# Altium schematic sheet 电源通道电路.SchDoc
size 508 x 762 mm
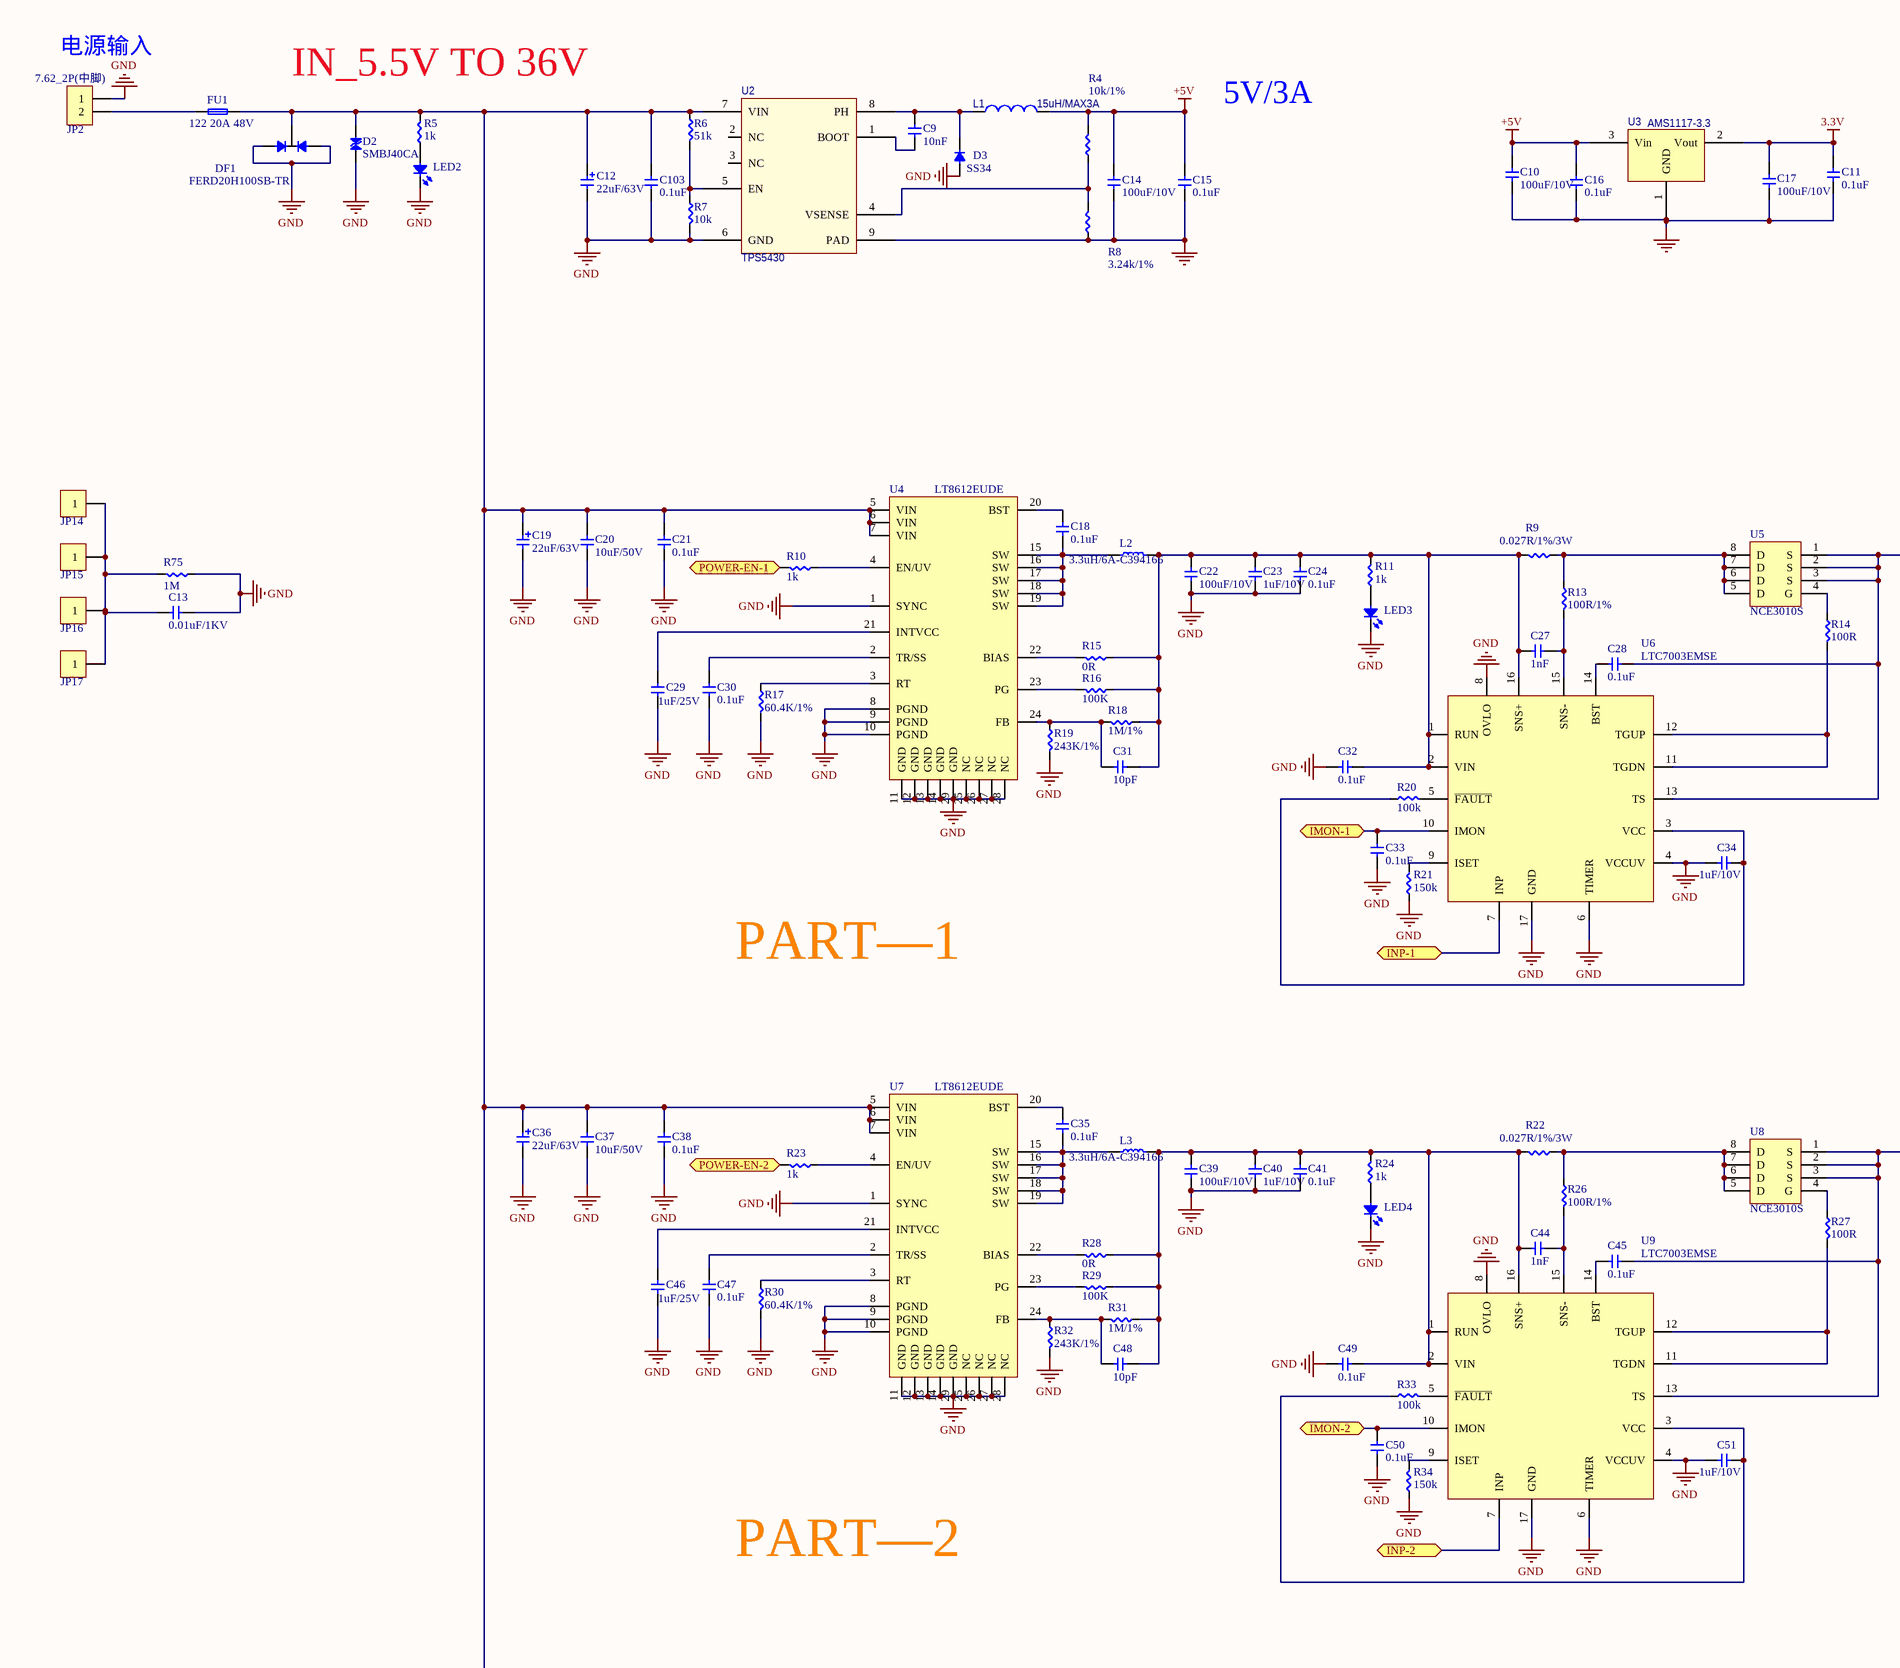
[diagram p0: 电源通道电路.SchDoc, top left]
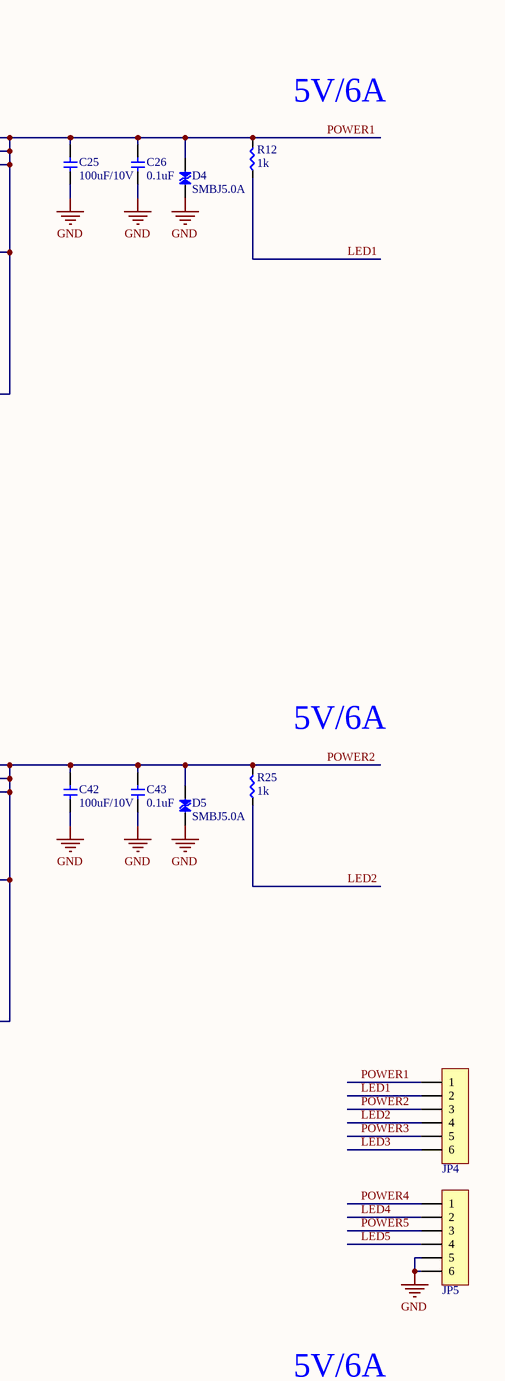
[diagram p1: 电源通道电路.SchDoc, top right]
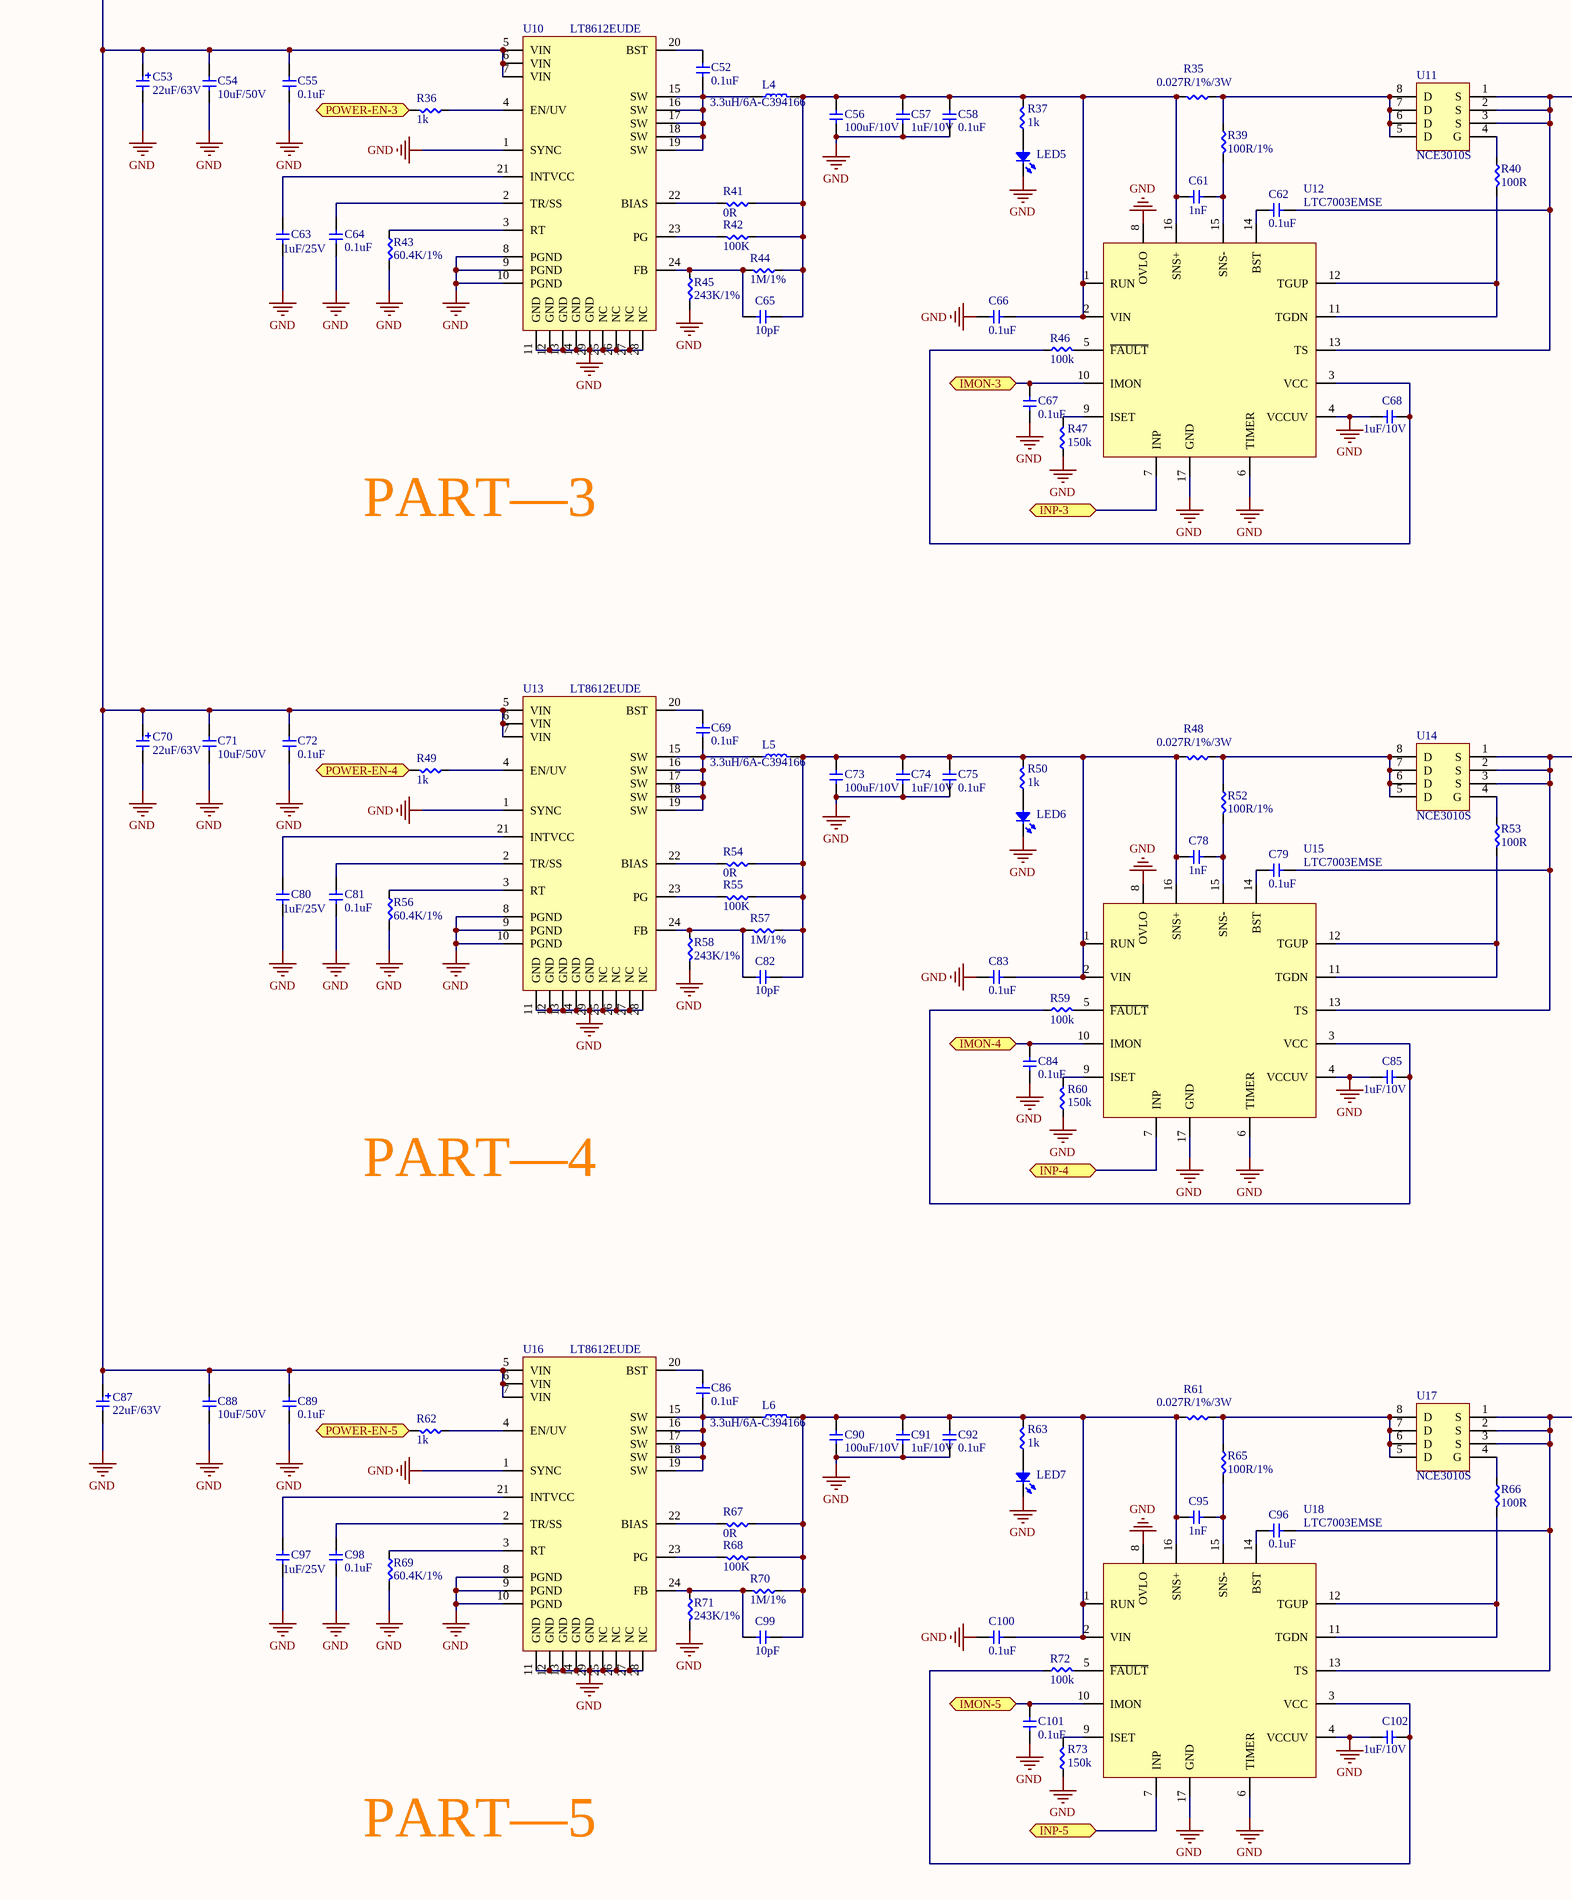
[diagram p2: 电源通道电路.SchDoc, bottom left]
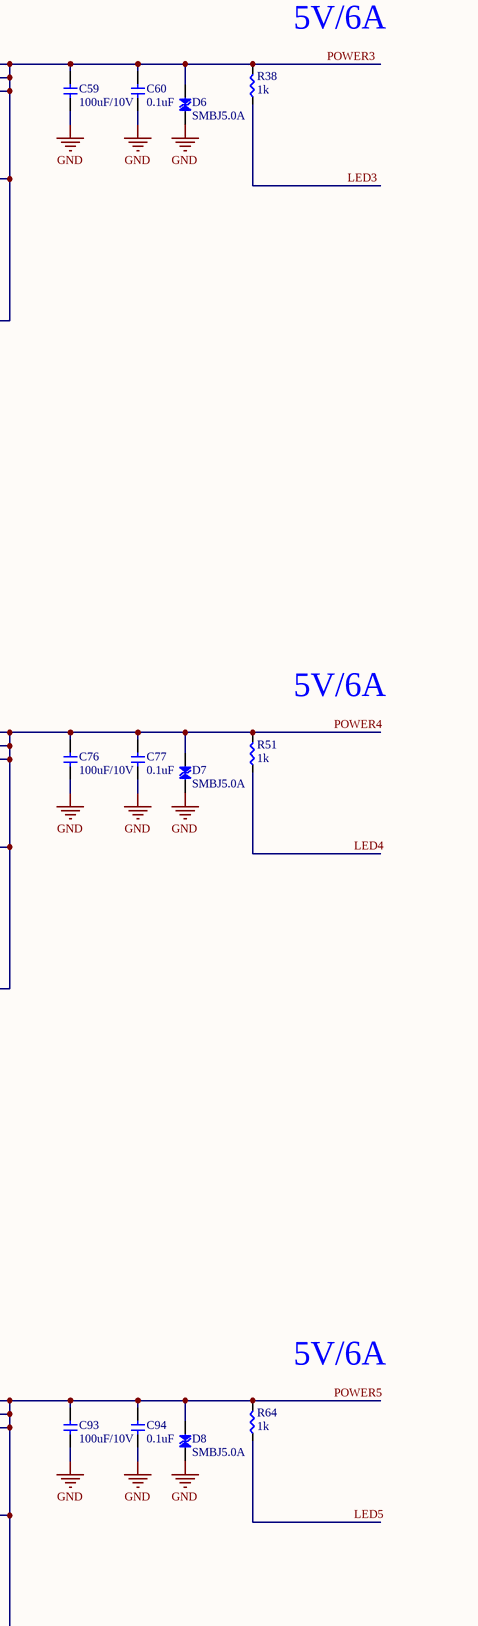
[diagram p3: 电源通道电路.SchDoc, bottom right]

## Parts
C9  10nF  [C 0603_M]
C10  100uF/10V  [CT 5*6 - R]
C11  0.1uF  [C 0603_M]
C12  22uF/63V  [CT 8*7 - C]
C13  0.01uF/1KV  [C 1210_M]
C14  100uF/10V  [CT 5*6 - R]
C15  0.1uF  [C 0603_M]
C16  0.1uF  [C 0603_M]
C17  100uF/10V  [CT 5*6 - R]
C18  0.1uF  [C 0603_M]
C19  22uF/63V  [CT 8*7 - C]
C20  10uF/50V  [C 1206_M]
C21  0.1uF  [C 0603_M]
C22  100uF/10V  [CT 5*6 - R]
C23  1uF/10V  [C 0603_M]
C24  0.1uF  [C 0603_M]
C25  100uF/10V  [CT 5*6 - R]
C26  0.1uF  [C 0603_M]
C27  1nF  [C 0603_M]
C28  0.1uF  [C 0603_M]
C29  1uF/25V  [C 0603_M]
C30  0.1uF  [C 0603_M]
C31  10pF  [C 0603_M]
C32  0.1uF  [C 0603_M]
C33  0.1uF  [C 0603_M]
C34  1uF/10V  [C 0603_M]
C35  0.1uF  [C 0603_M]
C36  22uF/63V  [CT 8*7 - C]
C37  10uF/50V  [C 1206_M]
C38  0.1uF  [C 0603_M]
C39  100uF/10V  [CT 5*6 - R]
C40  1uF/10V  [C 0603_M]
C41  0.1uF  [C 0603_M]
C42  100uF/10V  [CT 5*6 - R]
C43  0.1uF  [C 0603_M]
C44  1nF  [C 0603_M]
C45  0.1uF  [C 0603_M]
C46  1uF/25V  [C 0603_M]
C47  0.1uF  [C 0603_M]
C48  10pF  [C 0603_M]
C49  0.1uF  [C 0603_M]
C50  0.1uF  [C 0603_M]
C51  1uF/10V  [C 0603_M]
C52  0.1uF  [C 0603_M]
C53  22uF/63V  [CT 8*7 - C]
C54  10uF/50V  [C 1206_M]
C55  0.1uF  [C 0603_M]
C56  100uF/10V  [CT 5*6 - R]
C57  1uF/10V  [C 0603_M]
C58  0.1uF  [C 0603_M]
C59  100uF/10V  [CT 5*6 - R]
C60  0.1uF  [C 0603_M]
C61  1nF  [C 0603_M]
C62  0.1uF  [C 0603_M]
C63  1uF/25V  [C 0603_M]
C64  0.1uF  [C 0603_M]
C65  10pF  [C 0603_M]
C66  0.1uF  [C 0603_M]
C67  0.1uF  [C 0603_M]
C68  1uF/10V  [C 0603_M]
C69  0.1uF  [C 0603_M]
C70  22uF/63V  [CT 8*7 - C]
C71  10uF/50V  [C 1206_M]
C72  0.1uF  [C 0603_M]
C73  100uF/10V  [CT 5*6 - R]
C74  1uF/10V  [C 0603_M]
C75  0.1uF  [C 0603_M]
C76  100uF/10V  [CT 5*6 - R]
C77  0.1uF  [C 0603_M]
C78  1nF  [C 0603_M]
C79  0.1uF  [C 0603_M]
C80  1uF/25V  [C 0603_M]
C81  0.1uF  [C 0603_M]
C82  10pF  [C 0603_M]
C83  0.1uF  [C 0603_M]
C84  0.1uF  [C 0603_M]
C85  1uF/10V  [C 0603_M]
C86  0.1uF  [C 0603_M]
C87  22uF/63V  [CT 8*7 - C]
C88  10uF/50V  [C 1206_M]
C89  0.1uF  [C 0603_M]
C90  100uF/10V  [CT 5*6 - R]
C91  1uF/10V  [C 0603_M]
C92  0.1uF  [C 0603_M]
C93  100uF/10V  [CT 5*6 - R]
C94  0.1uF  [C 0603_M]
C95  1nF  [C 0603_M]
C96  0.1uF  [C 0603_M]
C97  1uF/25V  [C 0603_M]
C98  0.1uF  [C 0603_M]
C99  10pF  [C 0603_M]
C100  0.1uF  [C 0603_M]
C101  0.1uF  [C 0603_M]
C102  1uF/10V  [C 0603_M]
C103  0.1uF  [C 0603_M]
D2  SMBJ40CA  [SMB - TVS]
D3  SS34  [SMA]
D4  SMBJ5.0A  [SMB - TVS]
D5  SMBJ5.0A  [SMB - TVS]
D6  SMBJ5.0A  [SMB - TVS]
D7  SMBJ5.0A  [SMB - TVS]
D8  SMBJ5.0A  [SMB - TVS]
DF1  FERD20H100SB-TR  [DPAK_FERD20H100SB-TR]
FU1  122 20A 48V  [R 1206_M]
JP2  7.62_2P(中脚)  [7.62_2P(中脚)]
JP4  HDR-1X6  [7.62_6P(中脚)]  (value not drawn)
JP5  HDR-1X6  [7.62_6P(中脚)]  (value not drawn)
JP14  冷压插片  [M3 125X300]  (value not drawn)
JP15  冷压插片  [M3 125X300]  (value not drawn)
JP16  冷压插片  [M3 125X300]  (value not drawn)
JP17  冷压插片  [M3 125X300]  (value not drawn)
L1  15uH/MAX3A  [CDRH74]
L2  3.3uH/6A-C394166  [7045]
L3  3.3uH/6A-C394166  [7045]
L4  3.3uH/6A-C394166  [7045]
L5  3.3uH/6A-C394166  [7045]
L6  3.3uH/6A-C394166  [7045]
LED2  LED  [LED 0603G]  (value not drawn)
LED3  LED  [LED 0603G]  (value not drawn)
LED4  LED  [LED 0603G]  (value not drawn)
LED5  LED  [LED 0603G]  (value not drawn)
LED6  LED  [LED 0603G]  (value not drawn)
LED7  LED  [LED 0603G]  (value not drawn)
R4  10k/1%  [R 0603_M]
R5  1k  [R 0603_M]
R6  51k  [R 0603_M]
R7  10k  [R 0603_M]
R8  3.24k/1%  [R 0603_M]
R9  0.027R/1%/3W  [R 2512_M]
R10  1k  [R 0603_M]
R11  1k  [R 0603_M]
R12  1k  [R 0603_M]
R13  100R/1%  [R 0603_M]
R14  100R  [R 0603_M]
R15  0R  [R 0603_M]
R16  100K  [R 0603_M]
R17  60.4K/1%  [R 0603_M]
R18  1M/1%  [R 0603_M]
R19  243K/1%  [R 0603_M]
R20  100k  [R 0603_M]
R21  150k  [R 0603_M]
R22  0.027R/1%/3W  [R 2512_M]
R23  1k  [R 0603_M]
R24  1k  [R 0603_M]
R25  1k  [R 0603_M]
R26  100R/1%  [R 0603_M]
R27  100R  [R 0603_M]
R28  0R  [R 0603_M]
R29  100K  [R 0603_M]
R30  60.4K/1%  [R 0603_M]
R31  1M/1%  [R 0603_M]
R32  243K/1%  [R 0603_M]
R33  100k  [R 0603_M]
R34  150k  [R 0603_M]
R35  0.027R/1%/3W  [R 2512_M]
R36  1k  [R 0603_M]
R37  1k  [R 0603_M]
R38  1k  [R 0603_M]
R39  100R/1%  [R 0603_M]
R40  100R  [R 0603_M]
R41  0R  [R 0603_M]
R42  100K  [R 0603_M]
R43  60.4K/1%  [R 0603_M]
R44  1M/1%  [R 0603_M]
R45  243K/1%  [R 0603_M]
R46  100k  [R 0603_M]
R47  150k  [R 0603_M]
R48  0.027R/1%/3W  [R 2512_M]
R49  1k  [R 0603_M]
R50  1k  [R 0603_M]
R51  1k  [R 0603_M]
R52  100R/1%  [R 0603_M]
R53  100R  [R 0603_M]
R54  0R  [R 0603_M]
R55  100K  [R 0603_M]
R56  60.4K/1%  [R 0603_M]
R57  1M/1%  [R 0603_M]
R58  243K/1%  [R 0603_M]
R59  100k  [R 0603_M]
R60  150k  [R 0603_M]
R61  0.027R/1%/3W  [R 2512_M]
R62  1k  [R 0603_M]
R63  1k  [R 0603_M]
R64  1k  [R 0603_M]
R65  100R/1%  [R 0603_M]
R66  100R  [R 0603_M]
R67  0R  [R 0603_M]
R68  100K  [R 0603_M]
R69  60.4K/1%  [R 0603_M]
R70  1M/1%  [R 0603_M]
R71  243K/1%  [R 0603_M]
R72  100k  [R 0603_M]
R73  150k  [R 0603_M]
R75  1M  [R 0603_M]
U2  TPS5430  [SOP127P780-9]
U3  AMS1117-3.3  [SOT-223-4]
U4  LT8612EUDE  [QFN-28_LT8612EUDE]
U5  NCE3010S  [SOP8]
U6  LTC7003EMSE  [MSOP-16]
U7  LT8612EUDE  [QFN-28_LT8612EUDE]
U8  NCE3010S  [SOP8]
U9  LTC7003EMSE  [MSOP-16]
U10  LT8612EUDE  [QFN-28_LT8612EUDE]
U11  NCE3010S  [SOP8]
U12  LTC7003EMSE  [MSOP-16]
U13  LT8612EUDE  [QFN-28_LT8612EUDE]
U14  NCE3010S  [SOP8]
U15  LTC7003EMSE  [MSOP-16]
U16  LT8612EUDE  [QFN-28_LT8612EUDE]
U17  NCE3010S  [SOP8]
U18  LTC7003EMSE  [MSOP-16]

## Ports
IMON-1, IMON-2, IMON-3, IMON-4, IMON-5, INP-1, INP-2, INP-3, INP-4, INP-5, POWER-EN-1, POWER-EN-2, POWER-EN-3, POWER-EN-4, POWER-EN-5

## Nets
3.3V: C11.2 C17.2 U3.2(Vout)
+5V: C10.2 C14.2 C15.2 C16.2 L1.2 R4.2 U3.3(Vin)
GND: C10.1 C11.1 C12.2 C13.1 C14.1 C15.1 C16.1 C17.1 C19.2 C20.1 C21.1 C22.1 C23.1 C24.1 C25.1 C26.1 C29.1 C30.1 C32.1 C33.2 C34.1 C36.2 C37.1 C38.1 C39.1 C40.1 C41.1 C42.1 C43.1 C46.1 C47.1 C49.1 C50.2 C51.1 C53.2 C54.1 C55.1 C56.1 C57.1 C58.1 C59.1 C60.1 C63.1 C64.1 C66.1 C67.2 C68.1 C70.2 C71.1 C72.1 C73.1 C74.1 C75.1 C76.1 C77.1 C80.1 C81.1 C83.1 C84.2 C85.1 C87.2 C88.1 C89.1 C90.1 C91.1 C92.1 C93.1 C94.1 C97.1 C98.1 C100.1 C101.2 C102.1 C103.1 D2.1(A) D3.1 D4.1(A) D5.1(A) D6.1(A) D7.1(A) D8.1(A) DF1.1(A) DF1.3(C) JP2.1 JP5.5 JP5.6 LED2.2(K) LED3.2(K) LED4.2(K) LED5.2(K) LED6.2(K) LED7.2(K) R7.2 R8.1 R17.2 R19.2 R21.1 R30.2 R32.2 R34.1 R43.2 R45.2 R47.1 R56.2 R58.2 R60.1 R69.2 R71.2 R73.1 R75.1 U2.6(GND) U2.9(PAD) U3.1(GND) U4.1(SYNC) U4.8(PGND) U4.9(PGND) U4.10(PGND) U4.11(GND) U4.12(GND) U4.13(GND) U4.14(GND) U4.25(NC) U4.26(NC) U4.27(NC) U4.28(NC) U4.29(GND) U6.4(VCCUV) U6.6(TIMER) U6.8(OVLO) U6.17(GND) U7.1(SYNC) U7.8(PGND) U7.9(PGND) U7.10(PGND) U7.11(GND) U7.12(GND) U7.13(GND) U7.14(GND) U7.25(NC) U7.26(NC) U7.27(NC) U7.28(NC) U7.29(GND) U9.4(VCCUV) U9.6(TIMER) U9.8(OVLO) U9.17(GND) U10.1(SYNC) U10.8(PGND) U10.9(PGND) U10.10(PGND) U10.11(GND) U10.12(GND) U10.13(GND) U10.14(GND) U10.25(NC) U10.26(NC) U10.27(NC) U10.28(NC) U10.29(GND) U12.4(VCCUV) U12.6(TIMER) U12.8(OVLO) U12.17(GND) U13.1(SYNC) U13.8(PGND) U13.9(PGND) U13.10(PGND) U13.11(GND) U13.12(GND) U13.13(GND) U13.14(GND) U13.25(NC) U13.26(NC) U13.27(NC) U13.28(NC) U13.29(GND) U15.4(VCCUV) U15.6(TIMER) U15.8(OVLO) U15.17(GND) U16.1(SYNC) U16.8(PGND) U16.9(PGND) U16.10(PGND) U16.11(GND) U16.12(GND) U16.13(GND) U16.14(GND) U16.25(NC) U16.26(NC) U16.27(NC) U16.28(NC) U16.29(GND) U18.4(VCCUV) U18.6(TIMER) U18.8(OVLO) U18.17(GND)
IMON-1: C33.1 U6.10(IMON) ; port IMON-1
IMON-2: C50.1 U9.10(IMON) ; port IMON-2
IMON-3: C67.1 U12.10(IMON) ; port IMON-3
IMON-4: C84.1 U15.10(IMON) ; port IMON-4
IMON-5: C101.1 U18.10(IMON) ; port IMON-5
INP-1: U6.7(INP) ; port INP-1
INP-2: U9.7(INP) ; port INP-2
INP-3: U12.7(INP) ; port INP-3
INP-4: U15.7(INP) ; port INP-4
INP-5: U18.7(INP) ; port INP-5
LED1: JP4.2 R12.1
LED2: JP4.4 R25.1
LED3: JP4.6 R38.1
LED4: JP5.2 R51.1
LED5: JP5.4 R64.1
POWER1: C25.2 C26.2 C28.1 D4.2(K) JP4.1 R12.2 U5.1(S) U5.2(S) U5.3(S) U6.13(TS)
POWER2: C42.2 C43.2 C45.1 D5.2(K) JP4.3 R25.2 U8.1(S) U8.2(S) U8.3(S) U9.13(TS)
POWER3: C59.2 C60.2 C62.1 D6.2(K) JP4.5 R38.2 U11.1(S) U11.2(S) U11.3(S) U12.13(TS)
POWER4: C76.2 C77.2 C79.1 D7.2(K) JP5.1 R51.2 U14.1(S) U14.2(S) U14.3(S) U15.13(TS)
POWER5: C93.2 C94.2 C96.1 D8.2(K) JP5.3 R64.2 U17.1(S) U17.2(S) U17.3(S) U18.13(TS)
POWER-EN-1: R10.2 ; port POWER-EN-1
POWER-EN-2: R23.2 ; port POWER-EN-2
POWER-EN-3: R36.2 ; port POWER-EN-3
POWER-EN-4: R49.2 ; port POWER-EN-4
POWER-EN-5: R62.2 ; port POWER-EN-5
NetC9_1: C9.1 U2.1(BOOT)
NetC9_2: C9.2 D3.2 L1.1 U2.8(PH)
NetC12_1: C12.1 C19.1 C20.2 C21.2 C36.1 C37.2 C38.2 C53.1 C54.2 C55.2 C70.1 C71.2 C72.2 C87.1 C88.2 C89.2 C103.2 D2.2(K) DF1.2(B) FU1.2 R5.2 R6.1 U2.7(VIN) U4.5(VIN) U4.6(VIN) U4.7(VIN) U7.5(VIN) U7.6(VIN) U7.7(VIN) U10.5(VIN) U10.6(VIN) U10.7(VIN) U13.5(VIN) U13.6(VIN) U13.7(VIN) U16.5(VIN) U16.6(VIN) U16.7(VIN)
NetC13_2: C13.2 JP14.1 JP15.1 JP16.1 JP17.1 R75.2
NetC18_1: C18.1 L2.1 U4.15(SW) U4.16(SW) U4.17(SW) U4.18(SW) U4.19(SW)
NetC18_2: C18.2 U4.20(BST)
NetC22_2: C22.2 C23.2 C24.2 C27.2 C31.1 C32.2 L2.2 R9.2 R11.2 R15.1 R16.1 R18.1 U6.1(RUN) U6.2(VIN) U6.16(SNS+)
NetC27_1: C27.1 R13.2 U6.15(SNS-)
NetC28_2: C28.2 U6.14(BST)
NetC29_2: C29.2 U4.21(INTVCC)
NetC30_2: C30.2 U4.2(TR/SS)
NetC31_2: C31.2 R18.2 R19.1 U4.24(FB)
NetC34_2: C34.2 R20.1 U6.3(VCC)
NetC35_1: C35.1 L3.1 U7.15(SW) U7.16(SW) U7.17(SW) U7.18(SW) U7.19(SW)
NetC35_2: C35.2 U7.20(BST)
NetC39_2: C39.2 C40.2 C41.2 C44.2 C48.1 C49.2 L3.2 R22.2 R24.2 R28.1 R29.1 R31.1 U9.1(RUN) U9.2(VIN) U9.16(SNS+)
NetC44_1: C44.1 R26.2 U9.15(SNS-)
NetC45_2: C45.2 U9.14(BST)
NetC46_2: C46.2 U7.21(INTVCC)
NetC47_2: C47.2 U7.2(TR/SS)
NetC48_2: C48.2 R31.2 R32.1 U7.24(FB)
NetC51_2: C51.2 R33.1 U9.3(VCC)
NetC52_1: C52.1 L4.1 U10.15(SW) U10.16(SW) U10.17(SW) U10.18(SW) U10.19(SW)
NetC52_2: C52.2 U10.20(BST)
NetC56_2: C56.2 C57.2 C58.2 C61.2 C65.1 C66.2 L4.2 R35.2 R37.2 R41.1 R42.1 R44.1 U12.1(RUN) U12.2(VIN) U12.16(SNS+)
NetC61_1: C61.1 R39.2 U12.15(SNS-)
NetC62_2: C62.2 U12.14(BST)
NetC63_2: C63.2 U10.21(INTVCC)
NetC64_2: C64.2 U10.2(TR/SS)
NetC65_2: C65.2 R44.2 R45.1 U10.24(FB)
NetC68_2: C68.2 R46.1 U12.3(VCC)
NetC69_1: C69.1 L5.1 U13.15(SW) U13.16(SW) U13.17(SW) U13.18(SW) U13.19(SW)
NetC69_2: C69.2 U13.20(BST)
NetC73_2: C73.2 C74.2 C75.2 C78.2 C82.1 C83.2 L5.2 R48.2 R50.2 R54.1 R55.1 R57.1 U15.1(RUN) U15.2(VIN) U15.16(SNS+)
NetC78_1: C78.1 R52.2 U15.15(SNS-)
NetC79_2: C79.2 U15.14(BST)
NetC80_2: C80.2 U13.21(INTVCC)
NetC81_2: C81.2 U13.2(TR/SS)
NetC82_2: C82.2 R57.2 R58.1 U13.24(FB)
NetC85_2: C85.2 R59.1 U15.3(VCC)
NetC86_1: C86.1 L6.1 U16.15(SW) U16.16(SW) U16.17(SW) U16.18(SW) U16.19(SW)
NetC86_2: C86.2 U16.20(BST)
NetC90_2: C90.2 C91.2 C92.2 C95.2 C99.1 C100.2 L6.2 R61.2 R63.2 R67.1 R68.1 R70.1 U18.1(RUN) U18.2(VIN) U18.16(SNS+)
NetC95_1: C95.1 R65.2 U18.15(SNS-)
NetC96_2: C96.2 U18.14(BST)
NetC97_2: C97.2 U16.21(INTVCC)
NetC98_2: C98.2 U16.2(TR/SS)
NetC99_2: C99.2 R70.2 R71.1 U16.24(FB)
NetC102_2: C102.2 R72.1 U18.3(VCC)
NetFU1_1: FU1.1 JP2.2
NetLED2_1: LED2.1(A) R5.1
NetLED3_1: LED3.1(A) R11.1
NetLED4_1: LED4.1(A) R24.1
NetLED5_1: LED5.1(A) R37.1
NetLED6_1: LED6.1(A) R50.1
NetLED7_1: LED7.1(A) R63.1
NetR4_1: R4.1 R8.2 U2.4(VSENSE)
NetR6_2: R6.2 R7.1 U2.5(EN)
NetR9_1: R9.1 R13.1 U5.5(D) U5.6(D) U5.7(D) U5.8(D)
NetR10_1: R10.1 U4.4(EN/UV)
NetR14_1: R14.1 U5.4(G)
NetR14_2: R14.2 U6.11(TGDN) U6.12(TGUP)
NetR15_2: R15.2 U4.22(BIAS)
NetR16_2: R16.2 U4.23(PG)
NetR17_1: R17.1 U4.3(RT)
NetR20_2: R20.2 U6.5(~{FAULT})
NetR21_2: R21.2 U6.9(ISET)
NetR22_1: R22.1 R26.1 U8.5(D) U8.6(D) U8.7(D) U8.8(D)
NetR23_1: R23.1 U7.4(EN/UV)
NetR27_1: R27.1 U8.4(G)
NetR27_2: R27.2 U9.11(TGDN) U9.12(TGUP)
NetR28_2: R28.2 U7.22(BIAS)
NetR29_2: R29.2 U7.23(PG)
NetR30_1: R30.1 U7.3(RT)
NetR33_2: R33.2 U9.5(~{FAULT})
NetR34_2: R34.2 U9.9(ISET)
NetR35_1: R35.1 R39.1 U11.5(D) U11.6(D) U11.7(D) U11.8(D)
NetR36_1: R36.1 U10.4(EN/UV)
NetR40_1: R40.1 U11.4(G)
NetR40_2: R40.2 U12.11(TGDN) U12.12(TGUP)
NetR41_2: R41.2 U10.22(BIAS)
NetR42_2: R42.2 U10.23(PG)
NetR43_1: R43.1 U10.3(RT)
NetR46_2: R46.2 U12.5(~{FAULT})
NetR47_2: R47.2 U12.9(ISET)
NetR48_1: R48.1 R52.1 U14.5(D) U14.6(D) U14.7(D) U14.8(D)
NetR49_1: R49.1 U13.4(EN/UV)
NetR53_1: R53.1 U14.4(G)
NetR53_2: R53.2 U15.11(TGDN) U15.12(TGUP)
NetR54_2: R54.2 U13.22(BIAS)
NetR55_2: R55.2 U13.23(PG)
NetR56_1: R56.1 U13.3(RT)
NetR59_2: R59.2 U15.5(~{FAULT})
NetR60_2: R60.2 U15.9(ISET)
NetR61_1: R61.1 R65.1 U17.5(D) U17.6(D) U17.7(D) U17.8(D)
NetR62_1: R62.1 U16.4(EN/UV)
NetR66_1: R66.1 U17.4(G)
NetR66_2: R66.2 U18.11(TGDN) U18.12(TGUP)
NetR67_2: R67.2 U16.22(BIAS)
NetR68_2: R68.2 U16.23(PG)
NetR69_1: R69.1 U16.3(RT)
NetR72_2: R72.2 U18.5(~{FAULT})
NetR73_2: R73.2 U18.9(ISET)

Not connected (* = marked no-connect by the designer): U2 2(NC) 3(NC)

## Notes on the sheet
- (near JP2) 电源输入
- IN_5.5V TO 36V
- 5V/3A
- (near R12) 5V/6A
- PART—1
- (near R25) 5V/6A
- PART—2
- (near R38) 5V/6A
- PART—3
- (near R51) 5V/6A
- PART—4
- (near R64) 5V/6A
- PART—5

## Library data of the parts
C9-C11 C13-C18 C20-C35 C37-C52 C54-C69 C71-C86 C88-C103 = C
C12 C19 C36 C53 C70 C87 = C+: Published: 8-Jun-2000; LatestRevisionDate: 17-Jul-2002; LatestRevisionNote: Re-released for DXP Platform.; PackageReference: RB7.6-15; Publisher: Altium Limited; PackageDescription: Polarized Capacitor (Radial); 2 Leads
D2 D4-D8 = D  TVS: Published: 8-Jun-2000; LatestRevisionDate: 17-Jul-2002; LatestRevisionNote: Re-released for DXP Platform.; PackageVersion: Sep-1996; PackageReference: SMC; Publisher: Altium Limited; PackageDescription: DO-214-AB/SMC; 2 C-Bend Leads; Body 7.9 x 5.9 mm, inc. leads (LxW); Code_JEDEC: DO-214-AB
D3 = D: Value: 4007; Published: 8-Jun-2000; LatestRevisionDate: 17-Jul-2002; LatestRevisionNote: Re-released for DXP Platform.; PackageVersion: Sep-1996; PackageReference: SMC; Publisher: Altium Limited; PackageDescription: DO-214-AB/SMC; 2 C-Bend Leads; Body 7.9 x 5.9 mm, inc. leads (LxW); Code_JEDEC: DO-214-AB
DF1 = D复合二极管
FU1 = FUSE
JP2 = Header 2: 2P接插件; 版权归属: 源创客; BOM名称: 2P接插件; 学习资源: www.ooocke.com
JP4 JP5 = Header 6: 6P接插件; 版权归属: 源创客; BOM名称: 6P接插件; 学习资源: www.ooocke.com
JP14-JP17 = 冷压插片: BOM名称: 10P接插件; 版权归属: 源创客; 学习资源: www.ooocke.com
L1 = INDUCTOR
L2-L6 = L: Code_IEC: 1005; Published: 8-Jun-2000; LatestRevisionDate: 29-May-2009; LatestRevisionNote: IPC-7351 Footprint Added.; PackageReference: 0402-A; Publisher: Altium Limited; PackageDescription: Chip Inductor; Code_JEITA: 0402; Value: 3.3uH/6A-C394166
R4-R73 R75 = Res
U2 = TPS5430: 3-A, Wide Input Range, Step-Down Converter
U3 = LM1117-33
U5 U8 U11 U14 U17 = IRF7240PBF
LED2-LED7 = LED: Published: 8-Jun-2000; LatestRevisionDate: 08-Jul-2005; LatestRevisionNote: Mech Layer 1 removed.; PackageReference: LED-0; Publisher: Altium Limited; PackageDescription: LED; 2 Leads